# Altium schematic sheet main.SchDoc
size 209 x 297 mm; Address1: Address1; Address2: Address2; Address3: Address3; Address4: Address4; SheetNumber: 1; SheetTotal: 1; Scale: 1:1; Разраб.: Михаил Каа; Обозначение документа: ZX_D_FIX.001 Э3; Пров.: no check; Утв.: chat; Номер листа: 1; Общее количество листов: 1; Наименование организации: Михаил Каа; Перв. применение: D_FIX.001; Наименование изделия 1: Delta fix; Наименование изделия 2: Схема электрическая; Наименование изделия 3: принципиальная; Нач. отд.: Нач. отд.; Фамилия нач. отд.: chat
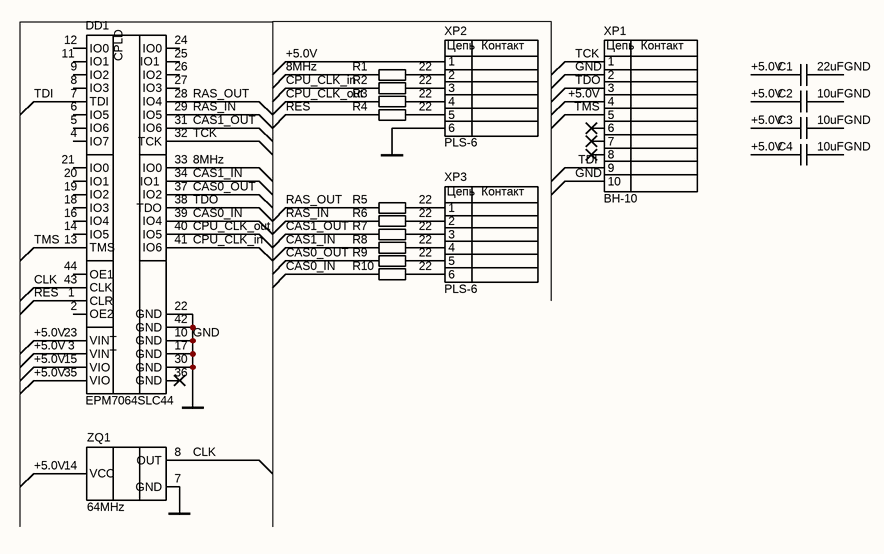
[diagram p0: main.SchDoc]

## Parts
C1  22uF  [С1206]
C2  10uF  [C0805]
C3  10uF  [C0805]
C4  10uF  [C0805]
DD1  EPM7064SLC44  [PLCC-44-R]
R1  22  [R0603]
R2  22  [R0603]
R3  22  [R0603]
R4  22  [R0603]
R5  22  [R0603]
R6  22  [R0603]
R7  22  [R0603]
R8  22  [R0603]
R9  22  [R0603]
R10  22  [R0603]
XP1  BH-10  [BH-10]
XP2  PLS-6  [6pin]
XP3  PLS-6  [6pin]
ZQ1  64MHz  [OSC_ECS-100A-240]

## Nets
GND: C1.2 C2.2 C3.2 C4.2 DD1.10(GND) DD1.17(GND) DD1.22(GND) DD1.30(GND) DD1.42(GND) XP1.2 XP1.10 XP2.6 ZQ1.7(GND)
8MHz: DD1.33(IO0) R1.1
+5.0V: C1.1 C2.1 C3.1 C4.1 DD1.3(VINT) DD1.15(VIO) DD1.23(VINT) DD1.35(VIO) XP1.4 XP2.1 ZQ1.14(VCC)
CAS0_IN: DD1.39(IO4) R10.1
CAS0_OUT: DD1.37(IO2) R9.1
CAS1_IN: DD1.34(IO1) R8.1
CAS1_OUT: DD1.31(IO6) R7.1
CLK: DD1.43(CLK) ZQ1.8(OUT)
CPU_CLK_in: DD1.41(IO6) R2.1
CPU_CLK_out: DD1.40(IO5) R3.1
RAS_IN: DD1.29(IO5) R6.1
RAS_OUT: DD1.28(IO4) R5.1
RES: DD1.1(CLR) R4.1
TCK: DD1.32(TCK) XP1.1
TDI: DD1.7(TDI) XP1.9
TDO: DD1.38(TDO) XP1.3
TMS: DD1.13(TMS) XP1.5
NetR1_2: R1.2 XP2.2
NetR2_2: R2.2 XP2.3
NetR3_2: R3.2 XP2.4
NetR4_2: R4.2 XP2.5
NetR5_2: R5.2 XP3.1
NetR6_2: R6.2 XP3.2
NetR7_2: R7.2 XP3.3
NetR8_2: R8.2 XP3.4
NetR9_2: R9.2 XP3.5
NetR10_2: R10.2 XP3.6

Not connected (* = marked no-connect by the designer): DD1 2(OE2) 4(IO7) 5(IO6) 6(IO5) 8(IO3) 9(IO2) 11(IO1) 12(IO0) 14(IO5) 16(IO4) 18(IO3) 19(IO2) 20(IO1) 21(IO0) 24(IO0) 25(IO1) 26(IO2) 27(IO3) 36(GND)* 44(OE1); XP1 6* 7* 8*

## Notes on the sheet
- Перв. примен.
- Справ. №
- Подп. и дата
- Инв. № дубл.
- Взам. инв. №
- Разраб.
- Изм.
- Лист
- № докум.
- Подп.
- Дата
- Лит.
- Масса
- Масштаб
- Пров.
- Т.контр.
- Листов
- Инв. № подл.
- Утв.
- Н.контр.
- Копировал
- Формат А4
- (in symbol BH-10) Цепь; Контакт
- (in symbol EPM7064SLC44) CPLD
- (in symbol PLS-6) Цепь; Контакт

## Library data of the parts
C1-C4 = CapCer
DD1 = EPM7064SLC44: 44-Pin PLCC44
R1-R10 = Res: 22 Ом 0603
XP1 = BH-10: 10 Position Total Dual Row 2.54 mm Pitch Straight Male Shrouded Box Header; MF: Sullins Connector; MP: SBH11-PBPC-D05-ST-BK; SnapEDA_Link: https://www.snapeda.com/parts/SBH11-PBPC-D05-ST-BK/Sullins+Connector+Solutions/view-part/?ref=snap; Package: None; Value: *; Check_prices: https://www.snapeda.com/parts/SBH11-PBPC-D05-ST-BK/Sullins+Connector+Solutions/view-part/?ref=eda
ZQ1 = KXO-240: Oscillator  14-DIP, 4 Leads (Full Size, Metal Can); MP: ECS-100A-240; Package: None; Price: None; Value: *; Availability: Unavailable